# EAGLE design core (EAGLE 6.4)
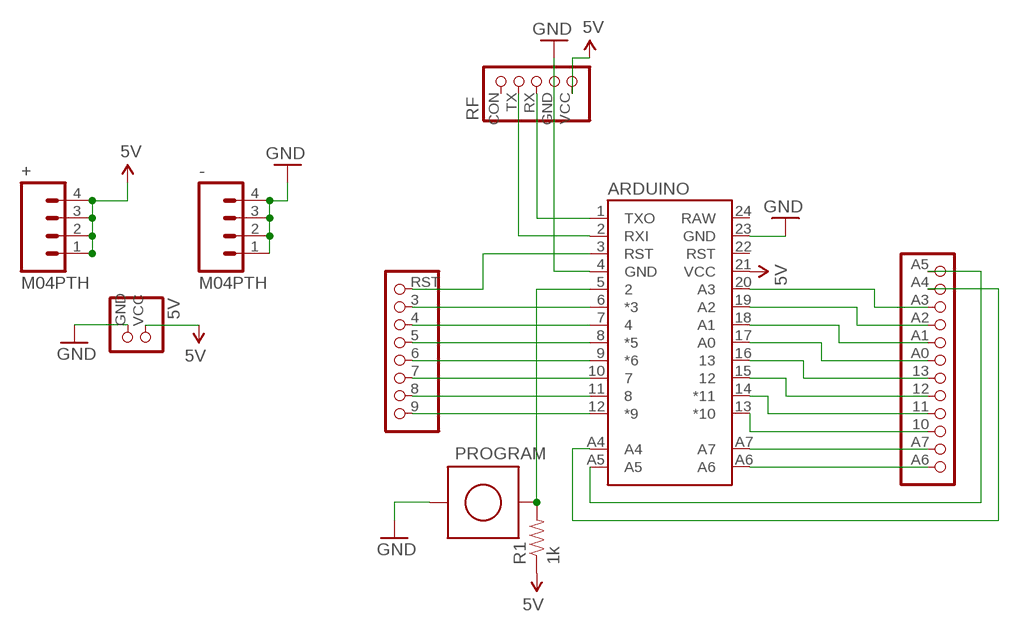
[diagram p0: schematic, sheet 1]

## Parts
5V  DCPINHD-1X2  [1X02]
+  M04PTH  [1X04]
-  M04PTH  [1X04]
ARDUINO  ARDUINO_PRO_MINI  [ARDUINO_PRO_MINI]
PROGRAM  PUSHBUTTON  [PUSHBUTTON]
R1  1k  RESISTORPTH-1/4W-VERT  [AXIAL-0.1]
RF  RFPINHD-1X5  [1X05]
U$1  RIGHTPINHD-1X12  [1X12]
U$2  LEFTPINHD-1X8  [1X08]

## Nets
5V: 5V.VCC +.1 +.2 +.3 +.4 ARDUINO.21(VCC) R1.P$1 RF.VCC
GND: 5V.GND -.1 -.2 -.3 -.4 ARDUINO.4(GND) ARDUINO.23(GND) PROGRAM.P$1 RF.GND
N$1: ARDUINO.A7 U$1.A7
N$2: ARDUINO.A6 U$1.A6
N$3: ARDUINO.13(*10) U$1.10
N$4: ARDUINO.14(*11) U$1.11
N$5: ARDUINO.15 U$1.12
N$6: ARDUINO.16 U$1.13
N$7: ARDUINO.17(A0) U$1.A0
N$8: ARDUINO.18(A1) U$1.A1
N$9: ARDUINO.19(A2) U$1.A2
N$10: ARDUINO.20(A3) U$1.A3
N$11: ARDUINO.A5 U$1.A5(A7)
N$12: ARDUINO.A4 U$1.A4
N$13: ARDUINO.1(TXO) RF.RX
N$14: ARDUINO.2(RXI) RF.TX
N$15: ARDUINO.12(*9) U$2.9
N$16: ARDUINO.11 U$2.8
N$17: ARDUINO.10 U$2.7
N$18: ARDUINO.9(*6) U$2.6
N$19: ARDUINO.8(*5) U$2.5
N$20: ARDUINO.7 U$2.4
N$21: ARDUINO.6(*3) U$2.3
N$22: ARDUINO.3(RST) U$2.RST
N$23: ARDUINO.5 PROGRAM.P$2 R1.P$2
Unconnected: ARDUINO.22(RST) ARDUINO.24(RAW) RF.CON

## Library data of the parts
5V = jalf:DCPINHD-1X2: PIN HEADER
+ - = jalf:M04: Header 4 Standard 4-pin 0.1" header. Use with straight break away headers (SKU : PRT-00116), right angle break away headers (PRT-00553), swiss pins (PRT-00743), machine pins (PRT-00117), and female headers (PRT-00115). Molex polarized connector foot print use with SKU : PRT-08231 with associated crimp pins and housings. 1MM SMD Version SKU: PRT-10208
ARDUINO = jalf:ARDUINO_PRO_MINI
PROGRAM = jalf:PUSHBUTTON
R1 = SparkFun-Resistors:RESISTOR: Resistor Basic schematic elements and footprints for 0603, 1206, and PTH resistors.
RF = jalf:RFPINHD-1X5: PIN HEADER
U$1 = jalf:RIGHTPINHD-1X12: RADIOINO RIGHT PIN HEADER
U$2 = jalf:LEFTPINHD-1X8: RADIOINO LEFT PIN HEADER

## Board
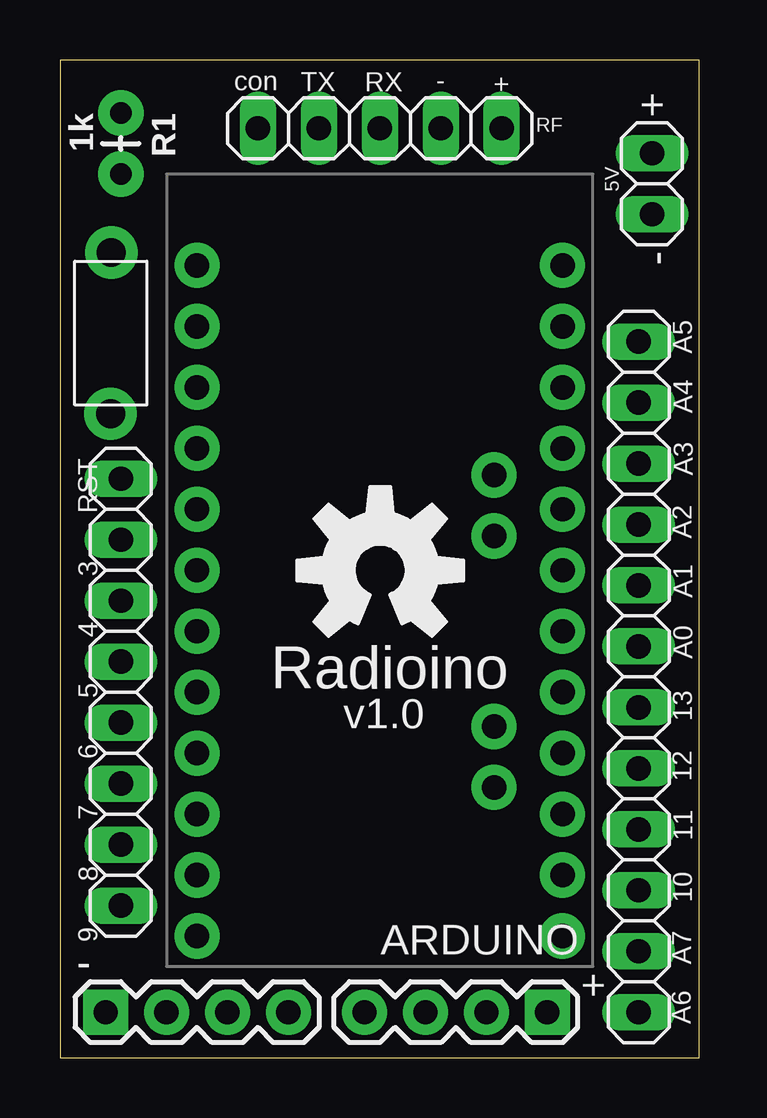
[diagram p1: board, top side]
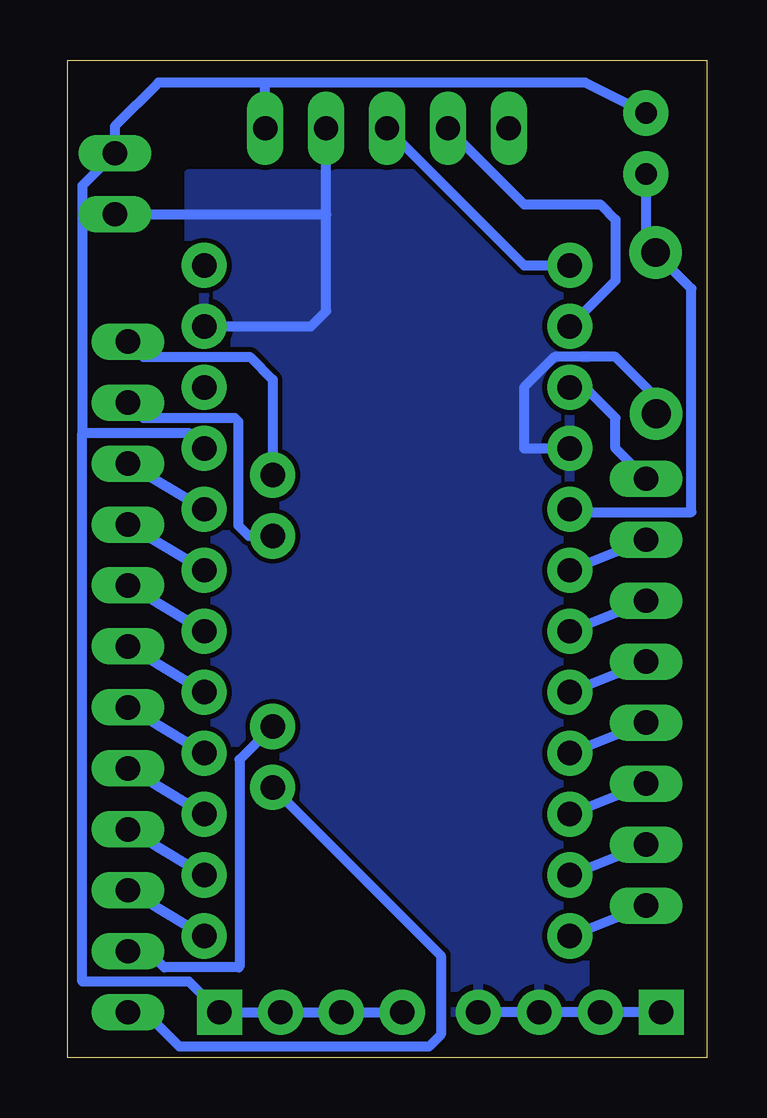
[diagram p2: board, bottom side, seen from below]

Size 26.65 x 41.58 mm. Coordinates in mm from the lower left corner, seen from the top.
Outline: 0,0 26.65,0 26.65,41.58 0,41.58 0,0
Copper layers (1*16): Top 0.035mm / dielectric 1.5mm / Bottom 0.035mm
Design rules "default": minimum track width 10mil, minimum drill 24mil, track to track 8mil, track to pad 8mil, pad to pad 8mil, via to via 8mil, smd to smd 8mil, copper to edge 40mil, drill to drill 8mil, minimum pad ring 10mil, minimum via ring 8mil, stop-mask expansion 4mil, vias tented up to drill 0mil, thermal gap 10mil

### Footprints (pad centres in the part's own frame; a part is rotated, then mirrored left to right if it is on the bottom)
1X02 = drill 1.016 long: GND 1.27,0; VCC -1.27,0
1X04 = drill 1.016 pad 1.88 square: 1 0,0 | drill 1.016 pad 1.88: 2 2.54,0; 3 5.08,0; 4 7.62,0
ARDUINO_PRO_MINI = drill 1.016 pad 1.88: 1 -7.62,12.7; 2 -7.62,10.16; 3 -7.62,7.62; 4 -7.62,5.08; 5 -7.62,2.54; 6 -7.62,0; 7 -7.62,-2.54; 8 -7.62,-5.08; 9 -7.62,-7.62; 10 -7.62,-10.16; 11 -7.62,-12.7; 12 -7.62,-15.24; 13 7.62,-15.24; 14 7.62,-12.7; 15 7.62,-10.16; 16 7.62,-7.62; 17 7.62,-5.08; 18 7.62,-2.54; 19 7.62,0; 20 7.62,2.54; 21 7.62,5.08; 22 7.62,7.62; 23 7.62,10.16; 24 7.62,12.7; A4 4.763,1.429; A5 4.763,3.969; A6 4.763,-9.049; A7 4.763,-6.509
PUSHBUTTON = drill 1.2 pad 2.184: P$1 -3.857,0.011; P$2 2.859,-0.018
AXIAL-0.1 = drill 0.9 pad 1.88: P$1 0,0; P$2 2.54,0
1X05 = drill 1.016 long: CON -5.08,0; GND 2.54,0; RX 0,0; TX -2.54,0; VCC 5.08,0
1X12 = drill 1.016 long: 10 -8.89,0; 11 -6.35,0; 12 -3.81,0; 13 -1.27,0; A0 1.27,0; A1 3.81,0; A2 6.35,0; A3 8.89,0; A4 11.43,0; A5 13.97,0; A6 -13.97,0; A7 -11.43,0
1X08 = drill 1.016 long: 3 6.35,0; 4 3.81,0; 5 1.27,0; 6 -1.27,0; 7 -3.81,0; 8 -6.35,0; 9 -8.89,0; RST 8.89,0

### Placement (x,y rotation side)
5V  24.68,36.42 270 top
+  20.32,1.91 180 top
-  1.91,1.91 0 top
ARDUINO  13.34,20.32 0 top
PROGRAM  2.12,30.7 90 top
R1  2.54,39.37 270 top
RF  13.34,38.73 0 top
U$1  24.13,15.88 90 top
U$2  2.54,15.24 90 top
U$3  [OSHW-LOGO-L]  13.35,20.32 0 top

### Tracks (layer width: path | path; a pad name or v marks a point on that pad's centre or on a via)
5V
  Bottom 0.406: +.4 +.3 +.2 +.1 21.59,3.17 26.04,3.17 26.04,26.04 | R1.P$1 5.08,40.64 18.41,40.64 | 18.41,40.64 22.86,40.64 24.68,38.82 5V.VCC 26.04,36.34 26.04,26.04 | RF.VCC 18.41,40.64 | ARDUINO.21 21.59,26.04 26.04,26.04
GND
  Bottom 0.406: -.1 -.2 -.3 -.4 | 5V.GND 15.88,35.15 | 15.88,35.15 RF.GND | ARDUINO.23 16.51,30.48 15.88,31.11 15.88,35.15 | PROGRAM.P$1 2.11,27.51 3.81,29.21 6.35,29.21 7.62,27.94 7.62,25.4 ARDUINO.4
  pour Bottom: 5.08,36.83 21.59,36.83 21.59,29.21 21.59,1.27 5.08,1.27
N$1
  Bottom 0.406: ARDUINO.A7 19.48,12.43 19.48,3.81 19.51,3.78 22.62,3.78 23.29,4.45 U$1.A7
N$2
  Bottom 0.406: ARDUINO.A6 11.09,4.26 11.09,0.97 11.59,0.47 21.98,0.47 23.42,1.91 U$1.A6
N$3
  Bottom 0.406: ARDUINO.13 U$1.10
N$4
  Bottom 0.406: ARDUINO.14 U$1.11
N$5
  Bottom 0.406: ARDUINO.15 U$1.12
N$6
  Bottom 0.406: ARDUINO.16 U$1.13
N$7
  Bottom 0.406: ARDUINO.17 U$1.A0
N$8
  Bottom 0.406: ARDUINO.18 U$1.A1
N$9
  Bottom 0.406: ARDUINO.19 U$1.A2
N$10
  Bottom 0.406: ARDUINO.20 U$1.A3
N$11
  Bottom 0.406: U$1.A5 23.5,29.21 19.05,29.21 18.1,28.26 ARDUINO.A5
N$12
  Bottom 0.406: U$1.A4 23.5,26.67 19.68,26.67 19.54,26.52 19.54,22.19 19.1,21.75 ARDUINO.A4
N$13
  Bottom 0.406: RF.RX 7.62,33.02 ARDUINO.1
N$14
  Bottom 0.406: RF.TX 7.62,35.56 4.45,35.56 3.81,34.92 3.81,32.38 ARDUINO.2
N$15
  Bottom 0.406: ARDUINO.12 U$2.9
N$16
  Bottom 0.406: ARDUINO.11 U$2.8
N$17
  Bottom 0.406: ARDUINO.10 U$2.7
N$18
  Bottom 0.406: ARDUINO.9 U$2.6
N$19
  Bottom 0.406: ARDUINO.8 U$2.5
N$20
  Bottom 0.406: ARDUINO.7 U$2.4
N$21
  Bottom 0.406: ARDUINO.6 U$2.3
N$22
  Bottom 0.406: U$2.RST 3.81,25.4 3.81,26.67 5.08,27.94 ARDUINO.3
N$23
  Bottom 0.406: R1.P$2 2.54,33.96 PROGRAM.P$2 0.64,32.06 0.64,22.75 5.6,22.75 ARDUINO.5

### Text on the board
tNames: Radioino | v1.0